# Altium schematic sheet yard-ice-toplevel.SchDoc: Yard-Ice-Top
size 365 x 274 mm; Revision: 0.2; SheetNumber: 1; SheetTotal: 5
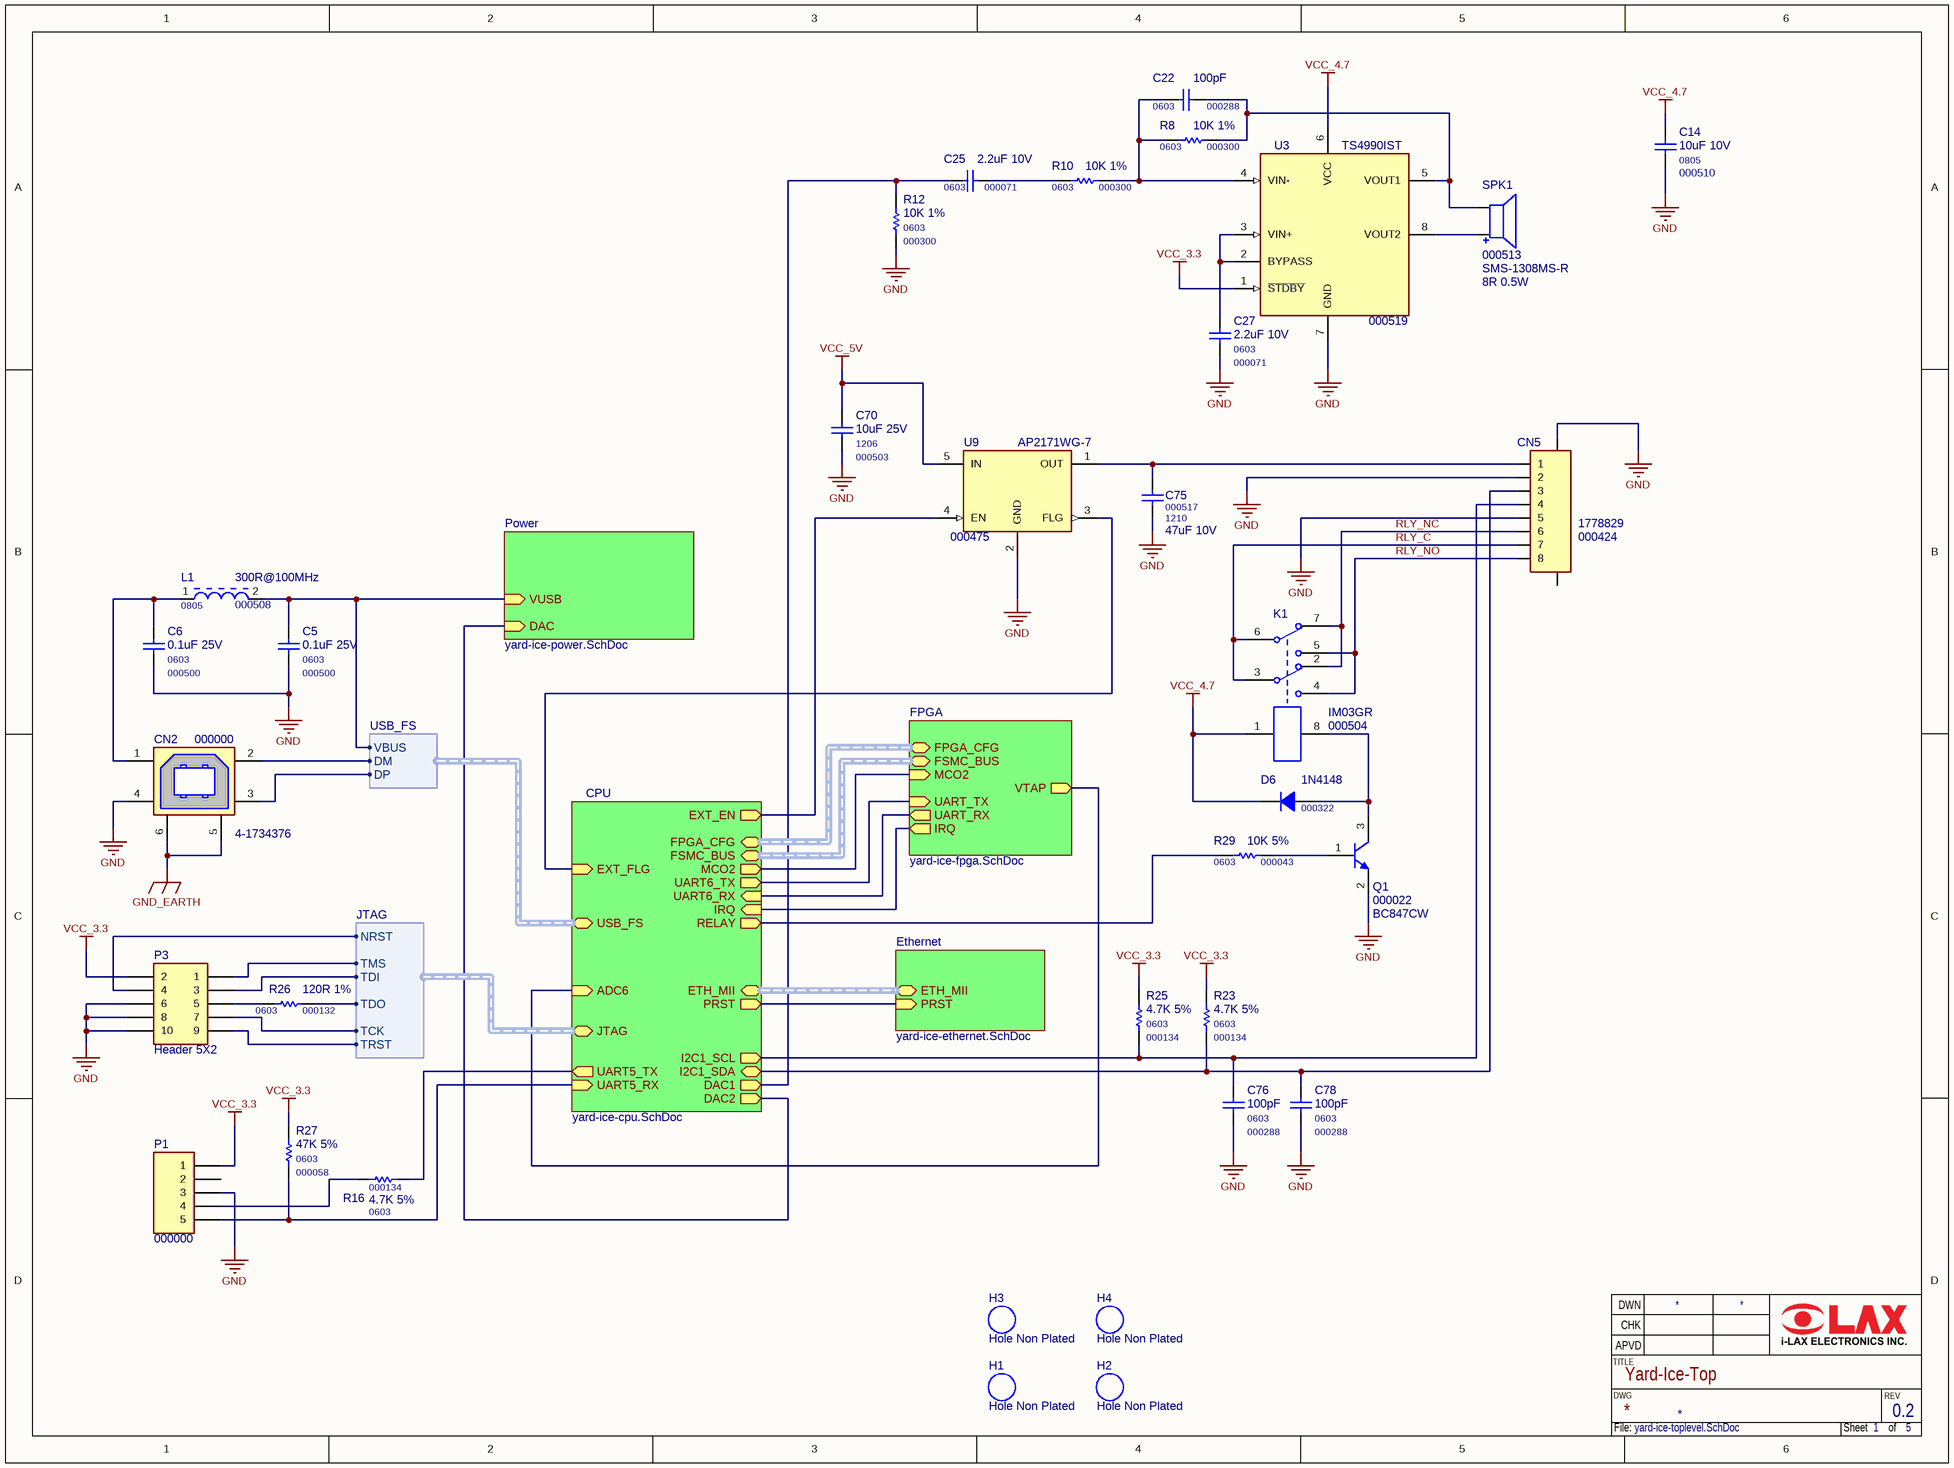
[diagram p0: yard-ice-toplevel.SchDoc]

## Parts
C5  000500  value 0.1uF 25V  Package: 0603  [C0603M]
C6  000500  value 0.1uF 25V  Package: 0603  [C0603M]
C14  000510  value 10uF 10V  Package: 0805  [C0805M]
C22  000288  value 100pF  Package: 0603  [C0603M]
C25  000071  value 2.2uF 10V  Package: 0603  [C0603M]
C27  000071  value 2.2uF 10V  Package: 0603  [C0603M]
C70  000503  value 10uF 25V  Package: 1206  [C1206M]
C75  000517  value 47uF 10V  Package: 1210  [C1210M]
C76  000288  value 100pF  Package: 0603  [C0603M]
C78  000288  value 100pF  Package: 0603  [C0603M]
CN2  000000  value 4-1734376  [4-1734376]
CN5  000424  value 1778829  [1778829]
D6  000322  value 1N4148  [SOD-123]
H1  Hole Non Plated  [Hole NP 3.2x5.0x5.0]
H2  Hole Non Plated  [Hole NP 3.2x5.0x5.0]
H3  Hole Non Plated  [Hole NP 3.2x5.0x5.0]
H4  Hole Non Plated  [Hole NP 3.2x5.0x5.0]
K1  000504  value IM03GR  [Relay-10X6]
L1  000508  value 300R@100MHz  Package: 0805  [L0805M]
P1  000000  [TSW-105-07-G-S]
P3  Header 5X2  [TSW-105-07-G-D]
Q1  000022  value BC847CW  [SOT-323]
R8  000300  value 10K 1%  Package: 0603  [R0603M]
R10  000300  value 10K 1%  Package: 0603  [R0603M]
R12  000300  value 10K 1%  Package: 0603  [R0603M]
R16  000134  value 4.7K 5%  Package: 0603  [R0603M]
R23  000134  value 4.7K 5%  Package: 0603  [R0603M]
R25  000134  value 4.7K 5%  Package: 0603  [R0603M]
R26  000132  value 120R 1%  Package: 0603  [R0603M]
R27  000058  value 47K 5%  Package: 0603  [R0603M]
R29  000043  value 10K 5%  Package: 0603  [R0603M]
SPK1  000513  value 8R 0.5W  [SMS-1308MS-R]
U3  000519  value TS4990IST  [MiniSO-8M]
U9  000475  value AP2171WG-7  [SOT-25]

## Sub-sheets
CPU = yard-ice-cpu.SchDoc: ETH_MII (harness ETH_MII), FSMC_BUS (harness FSMC_BUS), FPGA_CFG (harness FPGA_CFG), PRST (out), MCO2 (out), USB_FS (harness USB_FS), JTAG (harness JTAG), EXT_EN (out), EXT_FLG (in), ADC6 (in), DAC2 (out), I2C1_SDA (bidir), I2C1_SCL (out), UART6_TX (out), UART6_RX (in), UART5_TX (out), UART5_RX (in), RELAY (out), IRQ (in), DAC1 (out)
Ethernet = yard-ice-ethernet.SchDoc: ETH_MII (harness ETH_MII), PRST (in)
FPGA = yard-ice-fpga.SchDoc: FSMC_BUS (harness FSMC_BUS), FPGA_CFG (harness FPGA_CFG), MCO2 (in), VTAP (out), UART_TX (in), UART_RX (out), IRQ (out)
Power = yard-ice-power.SchDoc: VUSB (in), DAC (in)

## Harnesses
USB_FS: VBUS, DM, DP
JTAG: TDO, TDI, TCK, TMS, TRST, NRST

## Nets
GND: C5.2 C6.2 C14.2 C27.2 C70.2 C75.2 C76.2 C78.2 CN2.4 CN5.2 CN5.5 CN5.9 P1.3 P3.6 P3.8 P3.10 Q1.2(E) R12.1 U3.7(GND) U9.2(GND)
GND_EARTH: CN2.5(SHIELD) CN2.6(SHIELD)
VCC_3.3: P1.1 P3.2 R23.2 R25.2 R27.2 U3.1(~{STDBY})
VCC_4.7: C14.1 D6.2(K) K1.1 U3.6(VCC)
VCC_5V: C70.1 U9.5(IN)
RLY_C: CN5.7 K1.3 K1.6
RLY_NC: CN5.6 K1.2 K1.7
RLY_NO: CN5.8 K1.4 K1.5
NetC5_1: C5.1 L1.2 ; sheet Power/VUSB, sheet CPU/USB_FS.VBUS
NetC6_1: C6.1 CN2.1 L1.1
NetC22_1: C22.1 R8.2 R10.1 U3.4(VIN-)
NetC22_2: C22.2 R8.1 SPK1.2 U3.5(VOUT1)
NetC25_1: C25.1 R12.2 ; sheet CPU/DAC1
NetC25_2: C25.2 R10.2
NetC27_1: C27.1 U3.2(BYPASS) U3.3(VIN+)
NetC75_1: C75.1 CN5.1 U9.1(OUT)
NetC76_1: C76.1 CN5.4 R25.1 ; sheet CPU/I2C1_SCL
NetC78_1: C78.1 CN5.3 R23.1 ; sheet CPU/I2C1_SDA
NetCN2_2: CN2.2 ; sheet CPU/USB_FS.DM
NetCN2_3: CN2.3 ; sheet CPU/USB_FS.DP
NetD6_1: D6.1(A) K1.8 Q1.3(C)
NetP1_4: P1.4 R16.2
NetP1_5: P1.5 R27.1 ; sheet CPU/UART5_RX
NetP3_1: P3.1 ; sheet CPU/JTAG.TMS
NetP3_3: P3.3 ; sheet CPU/JTAG.TDI
NetP3_4: P3.4 ; sheet CPU/JTAG.NRST
NetP3_5: P3.5 R26.1
NetP3_7: P3.7 ; sheet CPU/JTAG.TCK
NetP3_9: P3.9 ; sheet CPU/JTAG.TRST
NetQ1_1: Q1.1(B) R29.1
NetR16_1: R16.1 ; sheet CPU/UART5_TX
NetR26_2: R26.2 ; sheet CPU/JTAG.TDO
NetR29_2: R29.2 ; sheet CPU/RELAY
NetSPK1_1: SPK1.1 U3.8(VOUT2)
NetU9_3: U9.3(FLG) ; sheet CPU/EXT_FLG
NetU9_4: U9.4(EN) ; sheet CPU/EXT_EN
(unnamed): sheet Power/DAC, sheet CPU/DAC2
(unnamed): sheet CPU/PRST, sheet Ethernet/PRST
(unnamed): sheet CPU/MCO2, sheet FPGA/MCO2
(unnamed): sheet CPU/ADC6, sheet FPGA/VTAP
(unnamed): sheet CPU/UART6_TX, sheet FPGA/UART_TX
(unnamed): sheet CPU/UART6_RX, sheet FPGA/UART_RX
(unnamed): sheet CPU/IRQ, sheet FPGA/IRQ

Not connected (* = marked no-connect by the designer): CN5 10; P1 2

## Buses and harness runs
harness sheet CPU/ETH_MII = sheet Ethernet/ETH_MII
harness sheet CPU/FPGA_CFG = sheet FPGA/FPGA_CFG
harness sheet CPU/FSMC_BUS = sheet FPGA/FSMC_BUS

## Notes on the sheet
- TITLE
- APVD
- DWN
- CHK
- DWG
- REV
- File:
- Sheet
- of

## Library data of the parts
C5 C6 = C0603: SMD Ceramic Chip Capacitor - 0603 - X7R; MF PN: C1608X7R1E104K; MF: TDK; PN: 000500
C14 = C0805: SMD Ceramic Chip Capacitor - 0805 - X7R; MF PN: C2012X7R1A106K; MF: TDK; PN: 000510
C22 C76 C78 = C0603: SMD Ceramic Chip Capacitor - 0603; PN: 000288
C25 = C0603: SMD Ceramic Chip Capacitor - 0603 - X7R; MF PN: LMK107B7225KA-T; MF: Taiyo Yuden; PN: 000071
C27 = C0603: SMD Ceramic Chip Capacitor - 0603 - X7R; MF: Taiyo Yuden; MF PN: LMK107B7225KA-T; PN: 000071
C70 = C1206: SMD Ceramic Chip Capacitor - 1206 - X7R; MF PN: TMK316B7106KL-TD; MF: Taiyo Yuden; PN: 000503
C75 = C12010: SMD Ceramic Chip Capacitor - 1210 - X7R; MF: Taiyo Yuden; MF PN: LMK325B7476MM-TR; PN: 000517
CN2 = 4-1734376: USB Type B - Right Angle - Thru Hole; MF: Tyco; PN: 000000; Package: PTH
CN5 = Combicon SMT 8: Terminal Block, Header, 8-Pos; MF: Phoenix Contacts; PN: 000424; Package: SMT
D6 = 1N4148W: Schottky Barrier Diode; MF: Diodes Inc; MF PN: 1N4148W-7-F; PN: 000322; Package: SOD-123
K1 = Relay-DPDT: Dual-Pole Dual-Throw Relay; MF: Tyco; PN: 000504; Package: SMT; MF PN: IM03GR
L1 = L0805: SMD Chip Inductor - 0805; MF PN: MMZ2012Y301B; MF: TDK; PN: 000508
P1 = Header 5: Header, 5-Pin; Value: 5x1; PN: 000000; Package: PTH
P3 = Header 5X2: Header 5-Pin, Dual row; PN: 000000; Package: PTH; Value: 5x2
Q1 = BC847CW: NPN General-purpose Transistor; MF: Diodes Inc; MF PN: BC847CW-7-F; PN: 000022; Package: SOT-323
R8 R10 R12 R16 R23 R25-R27 R29 = R0603: SMD Chip Resistor - 0603
  R8 R10 R12: PN: 000300
  R16 R23 R25: PN: 000134
  R26: PN: 000132
  R27: PN: 000058
  R29: PN: 000043
SPK1 = SMS-1308MS-R: Loudspeaker; MF: PUI-Audio; PN: 000513; Package: SMT; MF PN: SMS-1308MS-R
U3 = TS4990IST: 1.2 W audio power amplifier with active-low standby mode; PN: 000519; Package: TSSOP-8
U9 = AP2171W: 1A SINGLE CHANNEL CURRENT-LIMITED POWER  SWITCH; MF: Diodes Inc; Package: SOT23-5; PN: 000475